# EAGLE design chi2013 (EAGLE 6.5.0)
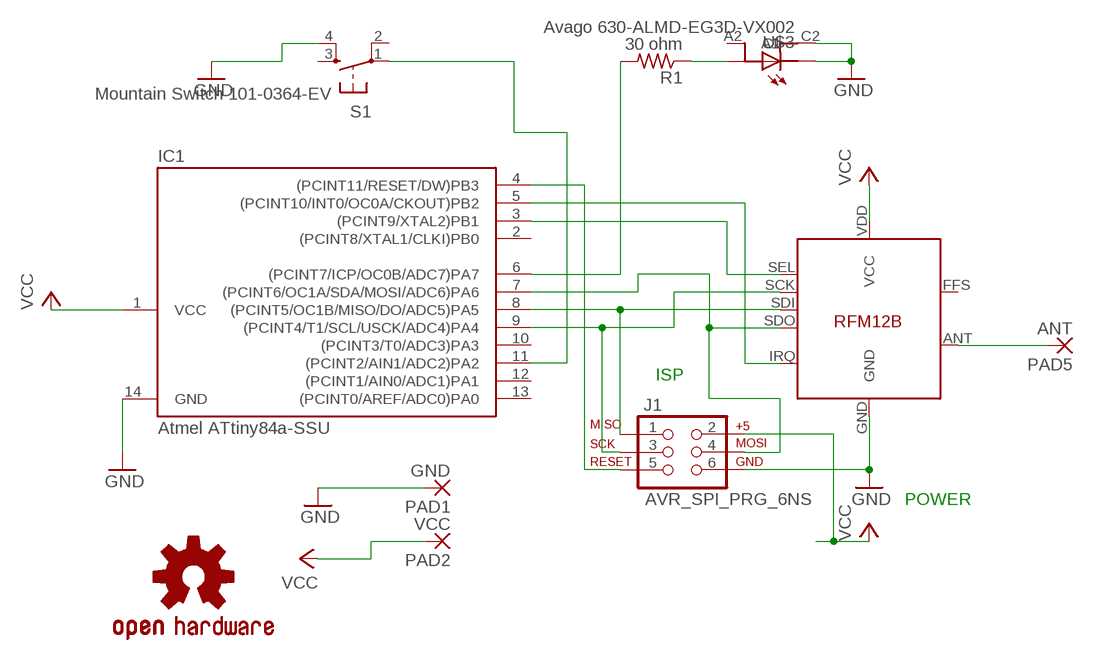
[diagram p0: schematic, sheet 1]

## Parts
IC1  Atmel ATtiny84a-SSU  TINY24/44/84-SSU  [SOIC14]
J1  AVR_SPI_PRG_6NS  [2X3-NS]
PAD1  GND  2,15/1,0  [2,15/1,0]
PAD2  VCC  2,15/1,0  [2,15/1,0]
PAD5  ANT  2,15/1,0  [2,15/1,0]
R1  30 ohm  R-US_R0805  [R0805]
RFM12B  HopeRF RFM12B-433S1  RFM12BN  [RFM12B-NARROW]
S1  Mountain Switch 101-0364-EV  DTSM-6  [DTSM-6]
U$1  OSHW-LOGOS  [OSHW-LOGO-S]
U$3  Avago 630-ALMD-EG3D-VX002  ALMD-XX3D  [ALMD-**3D]

## Nets
GND [power]: IC1.14(GND) J1.6 PAD1.1(P) RFM12B.GND S1.4 U$3.C1(C) U$3.C2(C1)
N$1: R1.1 U$3.A1(A)
N$2: IC1.9((PCINT4/T1/SCL/USCK/ADC4)PA4) J1.3 RFM12B.SCK
N$3: IC1.8((PCINT5/OC1B/MISO/DO/ADC5)PA5) J1.1 RFM12B.SDI
N$4: IC1.7((PCINT6/OC1A/SDA/MOSI/ADC6)PA6) J1.4 RFM12B.SDO
N$5: IC1.3((PCINT9/XTAL2)PB1) RFM12B.SEL
N$6: IC1.6((PCINT7/ICP/OC0B/ADC7)PA7) R1.2
N$7: IC1.5((PCINT10/INT0/OC0A/CKOUT)PB2) RFM12B.IRQ
N$8: PAD5.1(P) RFM12B.ANT
N$10: IC1.11((PCINT2/AIN1/ADC2)PA2) S1.1
N$14: IC1.4((PCINT11/RESET/DW)PB3) J1.5
VCC [power]: IC1.1(VCC) J1.2 PAD2.1(P) RFM12B.VDD(VCC)
Unconnected: IC1.2((PCINT8/XTAL1/CLKI)PB0) IC1.10((PCINT3/T0/ADC3)PA3) IC1.12((PCINT1/AIN0/ADC1)PA1) IC1.13((PCINT0/AREF/ADC0)PA0) RFM12B.FFS S1.2 S1.3 U$3.A2(A1)

## Notes on the sheet
- ISP
- POWER

## Library data of the parts
IC1 = avr-7:TINY24/44/84
J1 = SparkFun-Connectors:AVR_SPI_PRG_6: AVR ISP 6 Pin This is the reduced ISP connector for AVR programming. Common on Arduino. This footprint will take up less PCB space and can be used with a 10-pin to 6-pin adapter such as SKU: BOB-08508
PAD1 PAD2 PAD5 = wirepad:2,15/1,0: THROUGH-HOLE PAD
R1 = resistor:R-US_: RESISTOR, American symbol
RFM12B = JeeLabs:RFM12B
S1 = switch-tact:DTSM-6
U$1 = sfe-aesthetics:OSHW-LOGO: Open Source Hardware Logo This logo indicates the piece of hardware it is found on incorporates a OSHW license and/or adheres to the definition of open source hardware found here: http://freedomdefined.org/OSHW
U$3 = ALMD-XX3D:ALMD-XX3D

## Board
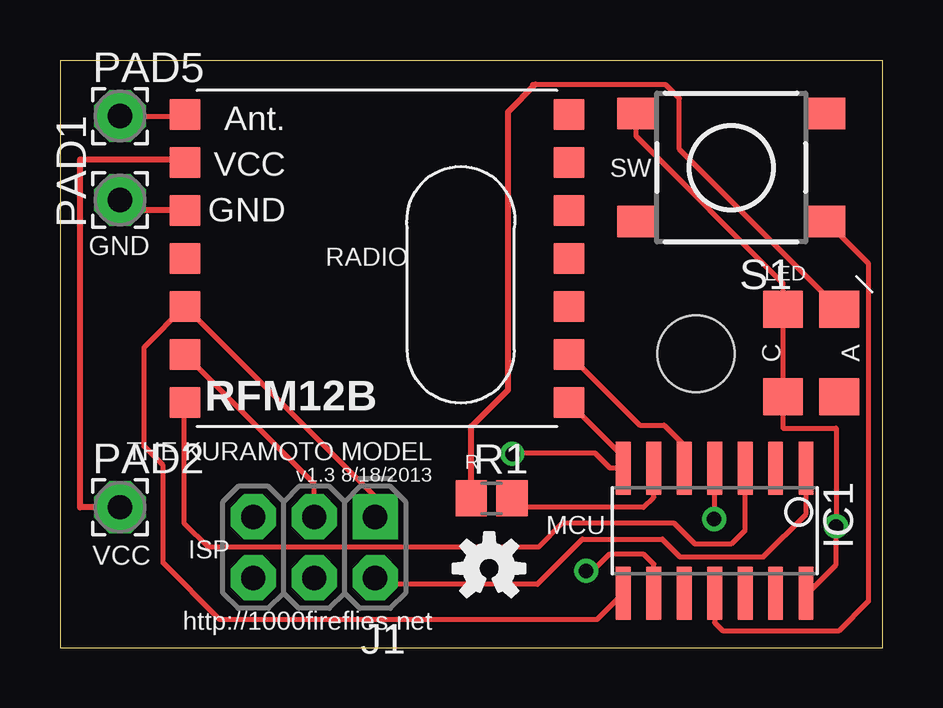
[diagram p1: board, top side]
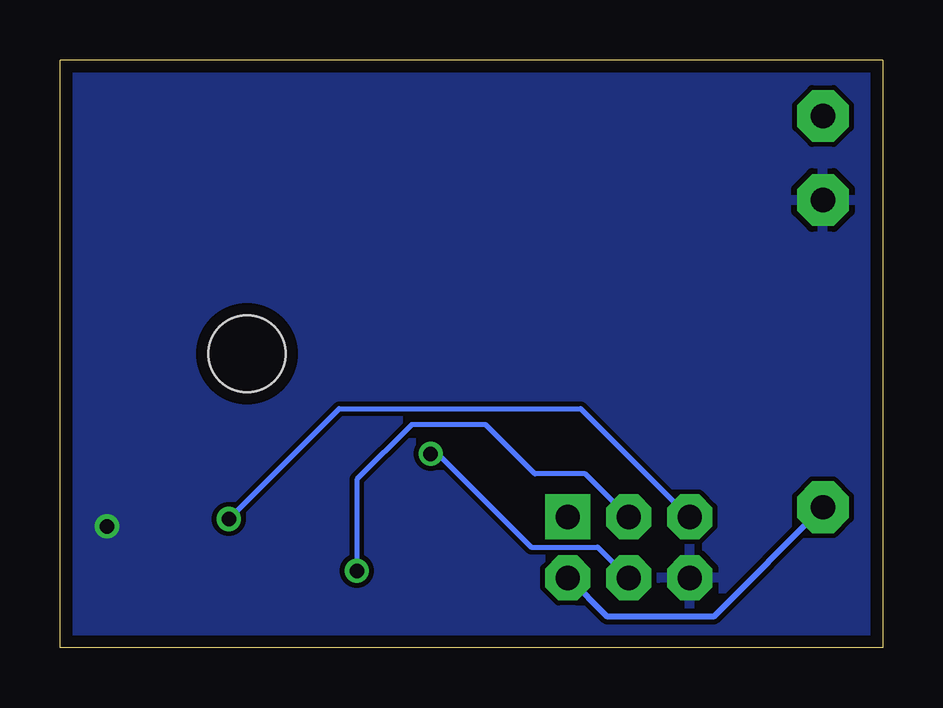
[diagram p2: board, bottom side, seen from below]

Size 34.29 x 24.49 mm. Coordinates in mm from the lower left corner, seen from the top.
Outline: 0,0 34.29,0 34.29,24.49 0,24.49 0,0
Copper layers (1*16): Top 0.0178mm / dielectric 59mil / Bottom 0.0178mm
Design rules "default": minimum track width 6mil, minimum drill 14mil, track to track 8mil, track to pad 8mil, pad to pad 8mil, via to via 8mil, smd to smd 8mil, copper to edge 20mil, drill to drill 16mil, minimum pad ring 8mil, minimum via ring 8mil, stop-mask expansion 3mil, vias tented up to drill 0mil, thermal gap 10mil
Holes 3.2 mm at 26.5,12.24
tKeepout: area 23.7,9.5 to 29.2,15
vRestrict: area 9.4,0.8 to 25.1,15

### Footprints (pad centres in the part's own frame; a part is rotated, then mirrored left to right if it is on the bottom)
SOIC14 = smd 0.61 x 2.21: 1 -3.81,-2.603; 2 -2.54,-2.603; 3 -1.27,-2.603; 4 0,-2.603; 5 1.27,-2.603; 6 2.54,-2.603; 7 3.81,-2.603; 8 3.81,2.603; 9 2.54,2.603; 10 1.27,2.603; 11 0,2.603; 12 -1.27,2.603; 13 -2.54,2.603; 14 -3.81,2.603
2X3-NS = drill 1.016 pad 1.88 square: 1 -2.54,-1.27 | drill 1.016 pad 1.88 octagon: 2 -2.54,1.27; 3 0,-1.27; 4 0,1.27; 5 2.54,-1.27; 6 2.54,1.27
2,15/1,0 = drill 1.016 pad 2.159 octagon: 1 0,0
R0805 = smd 1.3 x 1.5: 1 -0.85,0; 2 0.85,0
RFM12B-NARROW = smd 1.27 x 1.27: ANT 8,-6; FFS -8,2; GND 8,-2; IRQ -8,4; P$8 -8,0; P$9 -8,-2; P$10 -8,-4; P$12 -8,-6; P$16 8,0; SCK 8,4; SDI 8,2; SDO -8,6; SEL 8,6; VDD 8,-4
DTSM-6 = smd 1.55 x 1.3: 1 -3.975,2.25; 2 3.975,2.25; 3 -3.975,-2.25; 4 3.975,-2.25
ALMD-**3D = smd 1.55 x 1.65: A1 -1.825,1.175; A2 1.825,1.175; C1 -1.825,-1.175; C2 1.825,-1.175

### Placement (x,y rotation side)
IC1  27.28,4.88 180 top
J1  10.59,4.18 180 top
PAD1  2.5,18.65 90 top
PAD2  2.5,5.85 0 top
PAD5  2.5,22.15 0 top
R1  17.98,6.22 0 top
RFM12B  13.21,16.22 180 top
S1  27.97,20 180 top
U$1  17.88,3.3 0 top
U$3  31.29,12.28 270 top

### Tracks (layer width: path | path; a pad name or v marks a point on that pad's centre or on a via)
GND  (via drill 0.6)
  Top 0.203: IC1.14 31.15,2.27 32.33,3.45 v32.33,5.05 32.33,9.14 30.12,9.14 U$3.C2 U$3.C1 30.12,15.19 23.99,21.32 S1.4
  Top 0.254: RFM12B.GND 2.5,18.22 PAD1.1
  pour Bottom: -0.51,-0.51 34.82,-0.51 34.34,25.15 -0.61,25.35
N$1
  Top 0.203: U$3.A1 25.81,20.77 25.81,22.89 25.22,23.47 19.81,23.47 19.68,23.47
  Top 0.254: R1.1 17.13,9.21 18.67,10.74 18.67,22.33 19.81,23.47
N$2  (via drill 0.6)
  Top 0.203: J1.3 10.59,6.83 RFM12B.SCK | IC1.9 24.74,3.48 24.33,3.89 22.89,3.89 22.2,3.2 v21.92,3.2
  Bottom 0.203: J1.3 10.6,5.45 12.39,7.24 14.5,7.24 16.56,9.3 19.63,9.3 21.92,7.01 21.92,3.25 | 21.92,3.25 v21.92,3.2 | v21.92,3.2 21.92,3.17 | v21.92,3.2 21.95,3.25 21.92,3.25
N$3
  Top 0.203: J1.1 13.13,6.29 RFM12B.SDI 3.5,12.52 3.5,8.38 4.29,7.59 4.29,3.53 6.66,1.17 22.36,1.17 IC1.8
N$4  (via drill 0.6)
  Top 0.203: RFM12B.SDO 23.47,7.96 IC1.7 22.92,7.48 22.3,8.1 18.87,8.1 v18.85,8.08
  Bottom 0.203: v18.85,8.08 18.54,8.08 14.66,4.19 11.89,4.19 10.6,2.91 J1.4
N$5
  Top 0.203: RFM12B.SEL 5.18,10.19 5.18,5.16 6.17,4.19 19.94,4.19 20.93,5.18 25.6,5.18 26.47,4.32 27.96,4.32 28.55,4.9 IC1.3
N$6
  Top 0.203: R1.2 19.47,5.84 24.31,5.84 24.74,6.27 IC1.6
N$7
  Top 0.203: RFM12B.IRQ 24.16,9.27 25.17,9.27 26.01,8.43 IC1.5
N$8
  Top 0.203: PAD5.1 5.14,22.15 RFM12B.ANT
N$10
  Top 0.203: S1.1 33.68,16.01 33.68,1.93 32.46,0.71 27.61,0.71 27.28,1.04 IC1.11
N$14  (via drill 0.6)
  Top 0.203: IC1.4 27.25,7.46 v27.25,5.36
  Bottom 0.203: v27.25,5.36 22.66,9.96 12.6,9.96 8.09,5.45 J1.5
VCC
  Top 0.203: J1.2 13.4,2.64 19.89,2.64 21.77,4.52 25.09,4.52 25.83,3.79 29.31,3.79 31.09,5.56 IC1.1
  Top 0.254: PAD2.1 0.84,5.85 0.84,20.34 5.21,20.34 RFM12B.VDD
  Bottom 0.254: PAD2.1 7.05,1.29 11.48,1.29 13.09,2.91 J1.2

### Text on the board
tPlace: SW | RADIO | GND | LED | THE KURAMOTO MODEL | v1.3 8/18/2013 | R | MCU | VCC | ISP | http://1000fireflies.net